# EAGLE design wifi_thermo_v1.0 (EAGLE 9.6.2)
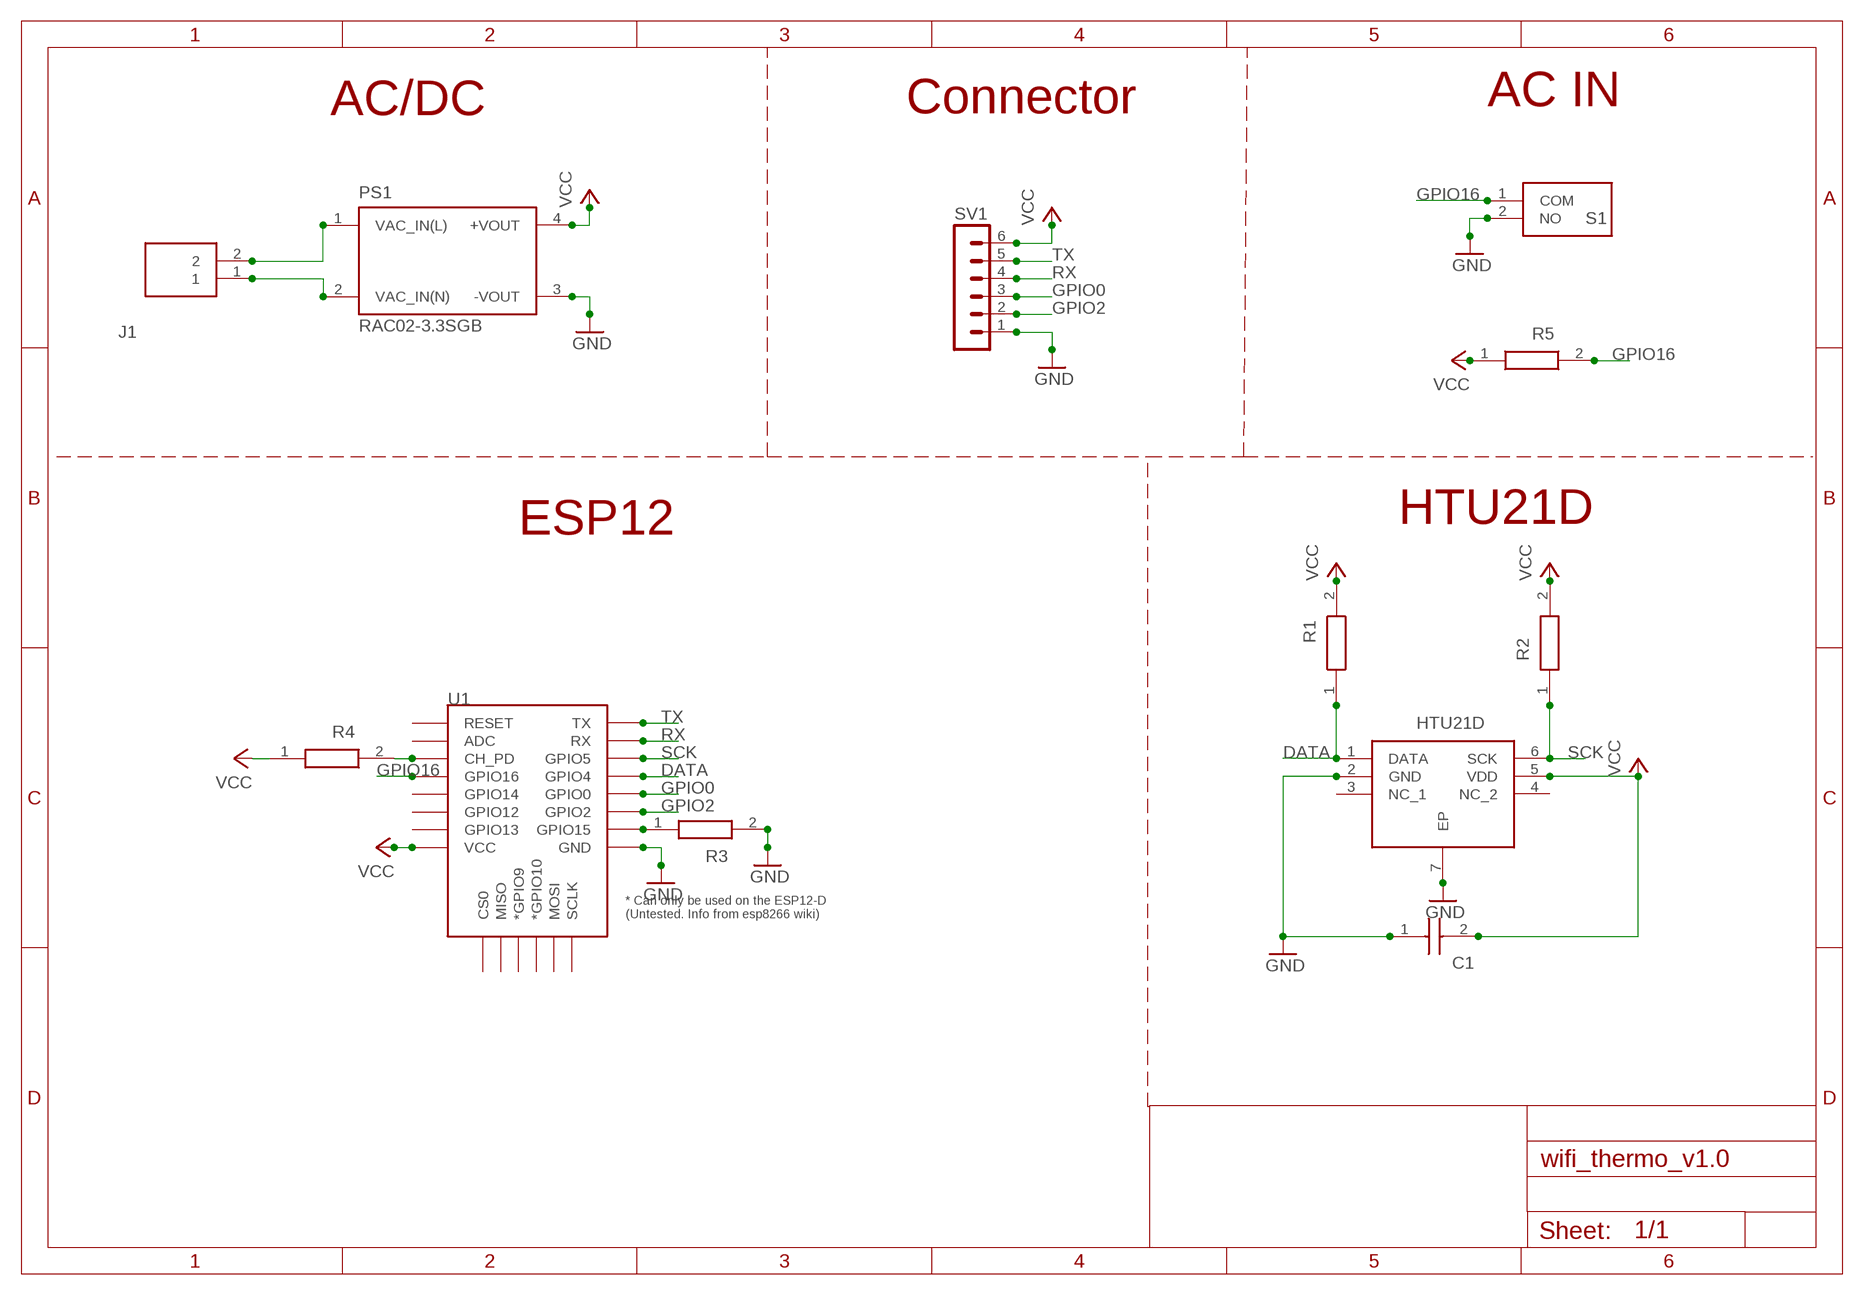
[diagram p0: schematic, sheet 1]

## Parts
C1  C1206C104J3GEC7210  [CAPC3216X110N]
HM1  HTU21D  [SON100P300X300X100-7N]
J1  TB006-508-02BE  [TB00650802BE]
PS1  RAC02-3.3SGB  [CONV_RAC02-3.3SGB]
R1  RT1206FRD0710KL  [RESC3116X65N]
R2  RT1206FRD0710KL  [RESC3116X65N]
R3  RT1206FRD0710KL  [RESC3116X65N]
R4  RT1206FRD0710KL  [RESC3116X65N]
R5  RT1206FRD0710KL  [RESC3116X65N]
S1  PTS636_SP50_SMTR_LFS  [PTS636SP50SMTRLFS]
SV1  MA06-1  [MA06-1]
U1  ESP12ESMD  [ESP12E-SMD]

## Nets
DATA: HM1.1(DATA) R1.1 U1.GPIO4
GND: C1.1 HM1.2(GND) HM1.7(EP) PS1.3(-VOUT) R3.2 S1.2(NO) SV1.1 U1.GND
GPIO0: SV1.3 U1.GPIO0
GPIO2: SV1.2 U1.GPIO2
GPIO16: R5.2 S1.1(COM) U1.GPIO16
N$1: J1.2 PS1.1(VAC_IN(L))
N$2: J1.1 PS1.2(VAC_IN(N))
N$7: R3.1 U1.GPIO15
N$8: R4.2 U1.CH_PD
RX: SV1.4 U1.RXD0(RX)
SCK: HM1.6(SCK) R2.1 U1.GPIO5
TX: SV1.5 U1.TXD0(TX)
VCC: C1.2 HM1.5(VDD) PS1.4(+VOUT) R1.2 R2.2 R4.1 R5.1 SV1.6 U1.VCC
Unconnected: HM1.3(NC_1) HM1.4(NC_2) U1.ADC U1.CS0 U1.GPIO9(*GPIO9) U1.GPIO10(*GPIO10) U1.GPIO12 U1.GPIO13 U1.GPIO14 U1.MISO U1.MOSI U1.RESET U1.SCLK

## Notes on the sheet
- AC/DC | Connector | AC IN
- ESP12 | HTU21D

## Library data of the parts
C1 = C1206C104J3GEC7210:C1206C104J3GEC7210: Multilayer Ceramic Capacitors MLCC - SMD/SMT 25V 0.1uF C0G 1206 5% Source: Datasheet <https://content.kemet.com/datasheets/KEM_C1003_C0G_SMD.pdf>; DESCRIPTION: Multilayer Ceramic Capacitors MLCC - SMD/SMT 25V 0.1uF C0G 1206 5%; HEIGHT: 1.1mm; MANUFACTURER_NAME: Kemet; MANUFACTURER_PART_NUMBER: C1206C104J3GEC7210; MOUSER_PART_NUMBER: 80-C1206C104J3GECLR; MOUSER_PRICE-STOCK: https://www.mouser.co.uk/ProductDetail/KEMET/C1206C104J3GEC7210?qs=55YtniHzbhDdQxeUSXwEWQ%3D%3D
HM1 = HTU21D:HTU21D: SENSOR SOLUTIONS - TE CONNECTIVITY - HTU21D - HUMIDITY/TEMP SENSOR, DIGITAL, DFN-6 Source: Datasheet <http://www.te.com/commerce/DocumentDelivery/DDEController?Action=showdoc&DocId=Data SheetHPC199_6A6pdfEnglishENG_DS_HPC199_6_A6.pdfCAT-HSC0004>; DESCRIPTION: SENSOR SOLUTIONS - TE CONNECTIVITY - HTU21D - HUMIDITY/TEMP SENSOR, DIGITAL, DFN-6; HEIGHT: 1mm; MANUFACTURER_NAME: TE Connectivity; MANUFACTURER_PART_NUMBER: HTU21D; MOUSER_PART_NUMBER: 824-HTU21D; MOUSER_PRICE-STOCK: https://www.mouser.co.uk/ProductDetail/Measurement-Specialties/HTU21D?qs=tx5doIiTu8oixw1WN5Uy8A%3D%3D
J1 = TB006-508-02BE:TB006-508-02BE: Fixed Terminal Blocks screw type, 5.08 , horizontal, 2 poles, CUI Blue, slotted screw, PCB mount Source: Datasheet; DESCRIPTION: Fixed Terminal Blocks screw type, 5.08 , horizontal, 2 poles, CUI Blue, slotted screw, PCB mount; HEIGHT: 10.4mm; MANUFACTURER_NAME: CUI Inc.; MANUFACTURER_PART_NUMBER: TB006-508-02BE; MOUSER_PART_NUMBER: 490-TB006-508-02BE; MOUSER_PRICE-STOCK: https://www.mouser.co.uk/ProductDetail/CUI-Devices/TB006-508-02BE?qs=vLWxofP3U2wEdOVV%2FaT04w%3D%3D
PS1 = RAC02-3.3SGB:RAC02-3.3SGB: AC/DC Converter, 2 Watt, Single Output, EMC Class B Check prices <https://pricing.snapeda.com/parts/RAC02-3.3SGB/Recom%20Power/view-part?ref=eda>; DESCRIPTION: 2W AC/DC-Converter 'POWERLINE' 3kV reg; MF: Recom Power; MP: RAC02-3.3SGB; PACKAGE: DIP-4 Recom Power; PRICE: None
R1-R5 = RT1206FRD0710KL:RT1206FRD0710KL: Thin Film Resistors - SMD Source: Datasheet; DESCRIPTION: Thin Film Resistors - SMD; HEIGHT: 0.65mm; MANUFACTURER_NAME: YAGEO (PHYCOMP); MANUFACTURER_PART_NUMBER: RT1206FRD0710KL; MOUSER_PART_NUMBER: 603-RT1206FRD0710KL; MOUSER_PRICE-STOCK: https://www.mouser.co.uk/ProductDetail/Yageo/RT1206FRD0710KL?qs=Fz%2FrpjPuTcHnXCbM3bUnCw%3D%3D
S1 = PTS636_SP50_SMTR_LFS:PTS636_SP50_SMTR_LFS: Tactile Switches Tact 50mA 12VDC, 6.0x3.5, 5.0mm H, 320gf, G leads, No ground pin, Black Actuator Source: Datasheet <https://componentsearchengine.com/Datasheets/1/PTS636 SP50 SMTR LFS.pdf>; DESCRIPTION: Tactile Switches Tact 50mA 12VDC, 6.0x3.5, 5.0mm H, 320gf, G leads, No ground pin, Black Actuator; HEIGHT: 5.2mm; MANUFACTURER_NAME: C & K COMPONENTS; MANUFACTURER_PART_NUMBER: PTS636 SP50 SMTR LFS; MOUSER_PART_NUMBER: 611-PTS636SP50SMTRLF; MOUSER_PRICE-STOCK: https://www.mouser.co.uk/ProductDetail/CK/PTS636-SP50-SMTR-LFS/?qs=vLWxofP3U2yQrwr1QnrRJw%3D%3D
SV1 = con-lstb:MA06-1: PIN HEADER; OC_FARNELL: unknown; OC_NEWARK: unknown
U1 = esp8266modules:ESP12E: ESP12E Module

## Board
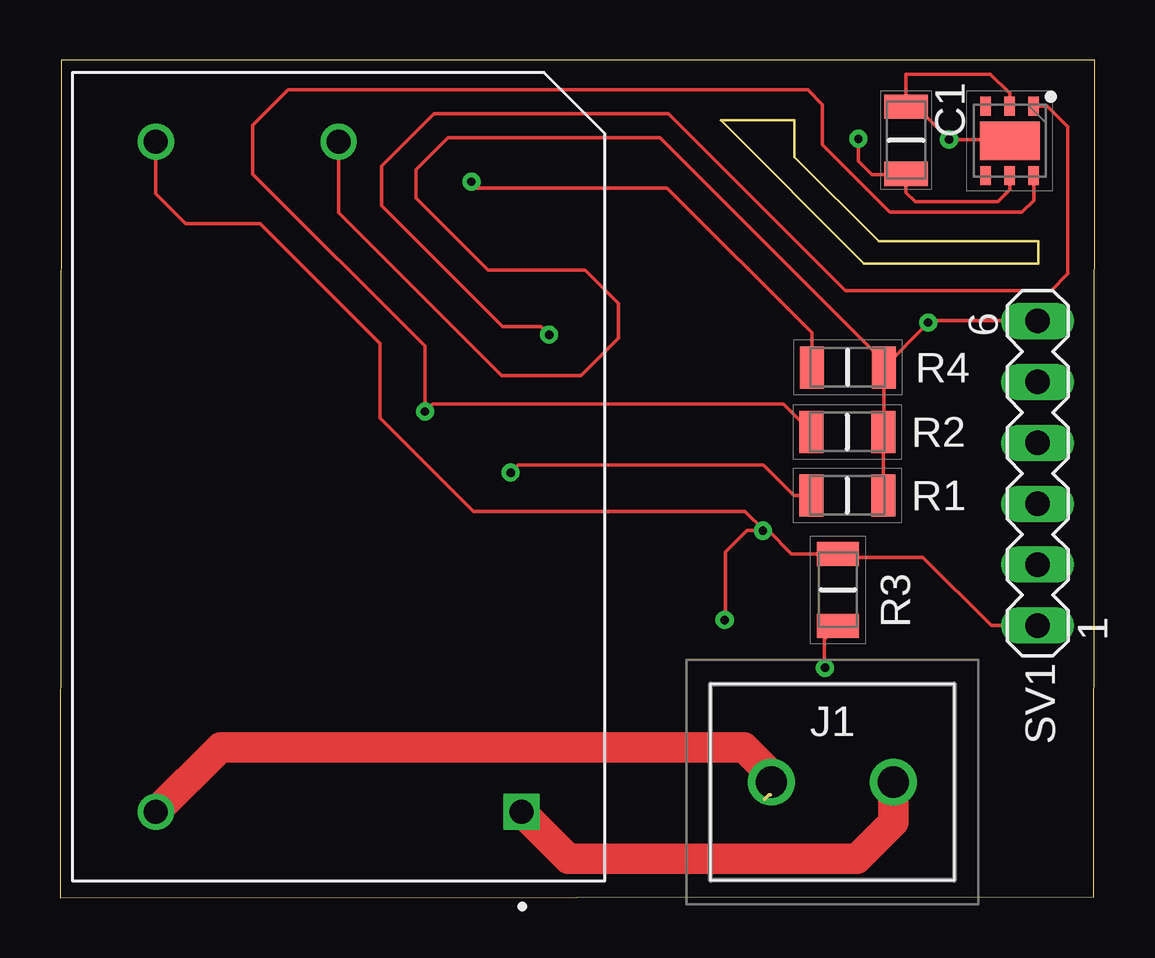
[diagram p1: board, top side]
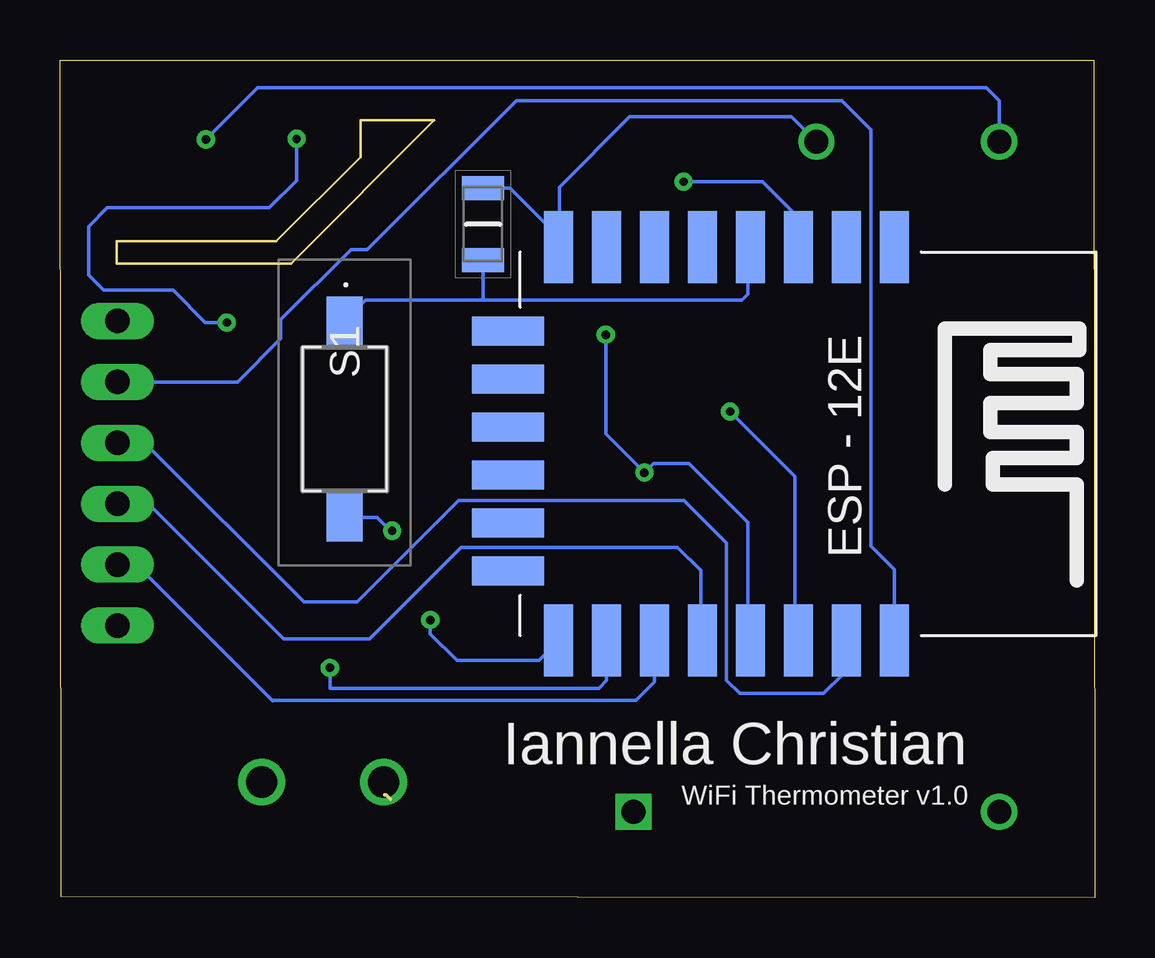
[diagram p2: board, bottom side, seen from below]

Size 43.14 x 34.93 mm. Coordinates in mm from the lower left corner, seen from the top.
Outline: 0,0 43.08,0.05 43.14,34.93 0.06,34.93 0,0
Outline: 27.55,32.42 33.51,26.44 40.77,26.44 40.77,27.39 34.13,27.38 30.62,30.87 30.62,32.41 27.55,32.42
Copper layers (1*16): Top 0.035mm / dielectric 1.5mm / Bottom 0.035mm
Design rules "untitled": minimum track width 6mil, minimum drill 0.35mm, track to track 0.205mm, track to pad 0.205mm, pad to pad 0.205mm, via to via 0.205mm, smd to smd 6mil, copper to edge 40mil, drill to drill 6mil, minimum pad ring 10mil, minimum via ring 8mil, stop-mask expansion 4mil, vias tented up to drill 0mil, thermal gap 10mil
Milling: 2 lines

### Footprints (pad centres in the part's own frame; a part is rotated, then mirrored left to right if it is on the bottom)
CAPC3216X110N = smd 1.02 x 1.82: 1 -1.4,0; 2 1.4,0
SON100P300X300X100-7N = smd 0.8 x 0.45: 1 -1.45,1; 2 -1.45,0; 3 -1.45,-1; 4 1.45,-1; 5 1.45,0; 6 1.45,1 | smd 1.6 x 2.5: 7 0,0
TB00650802BE = drill 1.3 pad 1.95: 1 0,0; 2 5.08,0
CONV_RAC02-3.3SGB = drill 1 pad 1.5 square: 1 -13.97,-7.62 | drill 1 pad 1.5: 2 -13.97,7.62; 3 13.97,7.62; 4 13.97,0
RESC3116X65N = smd 1 x 1.75: 1 -1.5,0; 2 1.5,0
PTS636SP50SMTRLFS = smd 2 x 1.5: 1 -4.1,0; 2 4.1,0
MA06-1 = drill 1.016 long: 1 -6.35,0; 2 -3.81,0; 3 -1.27,0; 4 1.27,0; 5 3.81,0; 6 6.35,0
ESP12E-SMD = smd 3 x 1.2: ADC -8.3,3.8; CH_PD -8.3,1.8; GND 8.1,-8.2; GPIO0 8.1,-2.2; GPIO2 8.1,-4.2; GPIO4 8.1,-0.2; GPIO5 8.1,1.8; GPIO12 -8.3,-4.2; GPIO13 -8.3,-6.2; GPIO14 -8.3,-2.2; GPIO15 8.1,-6.2; GPIO16 -8.3,-0.2; RESET -8.3,5.8; RXD0 8.1,3.8; TXD0 8.1,5.8; VCC -8.3,-8.2 | smd 1.2 x 3: CS0 -4.8,-10.3; GPIO9 -0.8,-10.3; GPIO10 1.2,-10.3; MISO -2.8,-10.3; MOSI 3.2,-10.3; SCLK 5.2,-10.3

### Placement (x,y rotation side)
C1  35.27,31.58 270 top
HM1  39.58,31.56 270 top
J1  29.66,4.82 0 top
PS1  11.62,17.56 90 top
R1  32.82,16.78 0 top
R2  32.82,19.42 0 top
R3  32.43,12.84 90 top
R4  32.83,22.12 180 top
R5  25.51,28.08 270 bottom
S1  31.28,19.96 270 bottom
SV1  40.76,17.7 90 top
U1  14.16,18.83 270 bottom

### Tracks (layer width: path | path; a pad name or v marks a point on that pad's centre or on a via)
DATA  (via drill 0.35)
  Top 0.152: HM1.1 41.16,33.01 42.02,32.16 42.02,26.02 41.31,25.32 32.73,25.32 25.37,32.69 15.59,32.69 13.41,30.51 13.41,28.85 18.45,23.82 20.05,23.82 v20.39,23.48 | v18.79,17.73 19.09,18.04 29.33,18.04 30.58,16.78 R1.1
  Bottom 0.152: U1.GPIO4 14.46,10.86 14.46,15.64 16.93,18.11 18.4,18.11 v18.79,17.73 20.39,19.34 v20.39,23.48
GND  (via drill 0.35)
  Top 0.152: SV1.1 38.83,11.35 35.98,14.2 32.57,14.2 R3.2 30.49,14.34 29.53,15.31 29.35,15.31 | PS1.3 4,29.35 5.24,28.11 8.34,28.11 13.34,23.1 13.34,20 17.25,16.1 28.56,16.1 29.35,15.31 | 29.35,15.31 v29.3,15.31 28.63,15.31 27.74,14.42 27.74,11.62 v27.71,11.58 | HM1.7 39.52,31.62 v37.06,31.62 35.85,32.83 35.42,32.83 C1.1 35.27,34.34 38.79,34.34 39.58,33.55 HM1.2
  Bottom 0.152: U1.GND 23.19,9.9 26.6,9.9 27.71,11.01 v27.71,11.58 | v29.3,15.31 29.37,15.31 29.92,15.86 S1.2 | v37.06,31.62 34.9,33.78 4.54,33.78 4,33.24 PS1.3
GPIO0
  Bottom 0.152: SV1.3 39.44,16.43 33.82,10.8 30.24,10.8 26.43,14.61 17.4,14.61 16.43,13.64 16.43,10.86 U1.GPIO0
GPIO2
  Bottom 0.152: U1.GPIO2 18.36,9.01 19.14,8.22 34.29,8.22 34.29,8.21 39.97,13.89 SV1.2
GPIO16
  Bottom 0.152: 25.46,24.92 14.72,24.92 14.46,25.18 14.46,27.12 U1.GPIO16 | 25.46,24.92 30.4,24.92 S1.1 | R5.2 25.51,24.97 25.46,24.92
N$1
  Top 1.27: PS1.1 21.2,1.62 33.22,1.62 34.74,3.14 J1.2
N$2
  Top 1.27: PS1.2 6.69,6.28 28.52,6.28 29.66,5.14 J1.1
N$7  (via drill 0.35)
  Top 0.152: v31.89,9.59 31.86,9.59 31.86,10.78 R3.1
  Bottom 0.152: v31.89,9.59 31.89,8.73 20.68,8.73 20.36,9.06 U1.GPIO15
N$8  (via drill 0.35)
  Top 0.152: v17.15,29.86 17.41,29.6 25.31,29.6 31.33,23.57 R4.2
  Bottom 0.152: v17.15,29.86 13.86,29.86 12.5,28.5 12.5,27.3 U1.CH_PD
RX
  Bottom 0.152: SV1.4 39.6,18.97 32.98,12.34 30.76,12.34 26.53,16.57 17.13,16.57 15.36,14.8 15.36,9.07 14.8,8.51 11.32,8.51 10.53,9.3 10.53,10.68 U1.RXD0
SCK  (via drill 0.35)
  Top 0.152: HM1.6 40.58,29.07 40.1,28.58 34.6,28.58 31.79,31.4 31.79,33.07 31.18,33.68 9.5,33.68 8.04,32.21 8.04,30.18 15.21,23 v15.21,20.27 15.53,20.59 30.15,20.59 R2.1
  Bottom 0.152: v15.21,20.27 12.5,17.56 12.5,10.86 U1.GPIO5
TX
  Bottom 0.152: U1.TXD0 8.36,13.69 9.34,14.67 9.34,32.03 10.56,33.24 24.12,33.24 30.34,27.02 31.02,27.02 33.94,24.1 33.94,23.31 35.74,21.51 SV1.5
VCC  (via drill 0.35)
  Top 0.152: R1.2 34.32,17.38 34.39,17.4 34.32,17.41 R2.2 34.34,19.45 R4.1 | SV1.6 40.74,24.07 36.29,24.07 36.19,23.97 | PS1.4 11.62,28.57 18.41,21.77 21.71,21.77 23.27,23.34 23.27,24.78 21.89,26.16 17.85,26.16 14.85,29.16 14.85,30.36 16.18,31.68 25.02,31.68 34.33,22.37 R4.1 | v36.19,23.98 36.19,23.97 | 36.19,23.97 R4.1 | HM1.5 39.58,29.52 39.09,29.03 35.65,29.03 35.27,29.41 35.27,30.16 | 35.27,30.16 C1.2 | v33.28,31.65 33.28,30.72 33.84,30.16 35.27,30.16
  Bottom 0.152: 22.33,27.53 22.33,29.64 19.41,32.56 12.65,32.56 PS1.4 | 22.33,27.53 22.33,27.3 U1.VCC | v33.28,31.65 33.28,29.9 34.42,28.77 41.18,28.77 41.95,27.99 41.95,25.96 41.32,25.33 38.43,25.33 37.09,23.98 v36.19,23.98 | R5.1 24.38,29.58 22.33,27.53

### Text on the board
bPlace: Iannella Christian | WiFi Thermometer v1.0